# Altium schematic sheet NEW_TOP.SchDoc
size A; DocumentNumber: 2; SheetNumber: 2; SheetTotal: 5
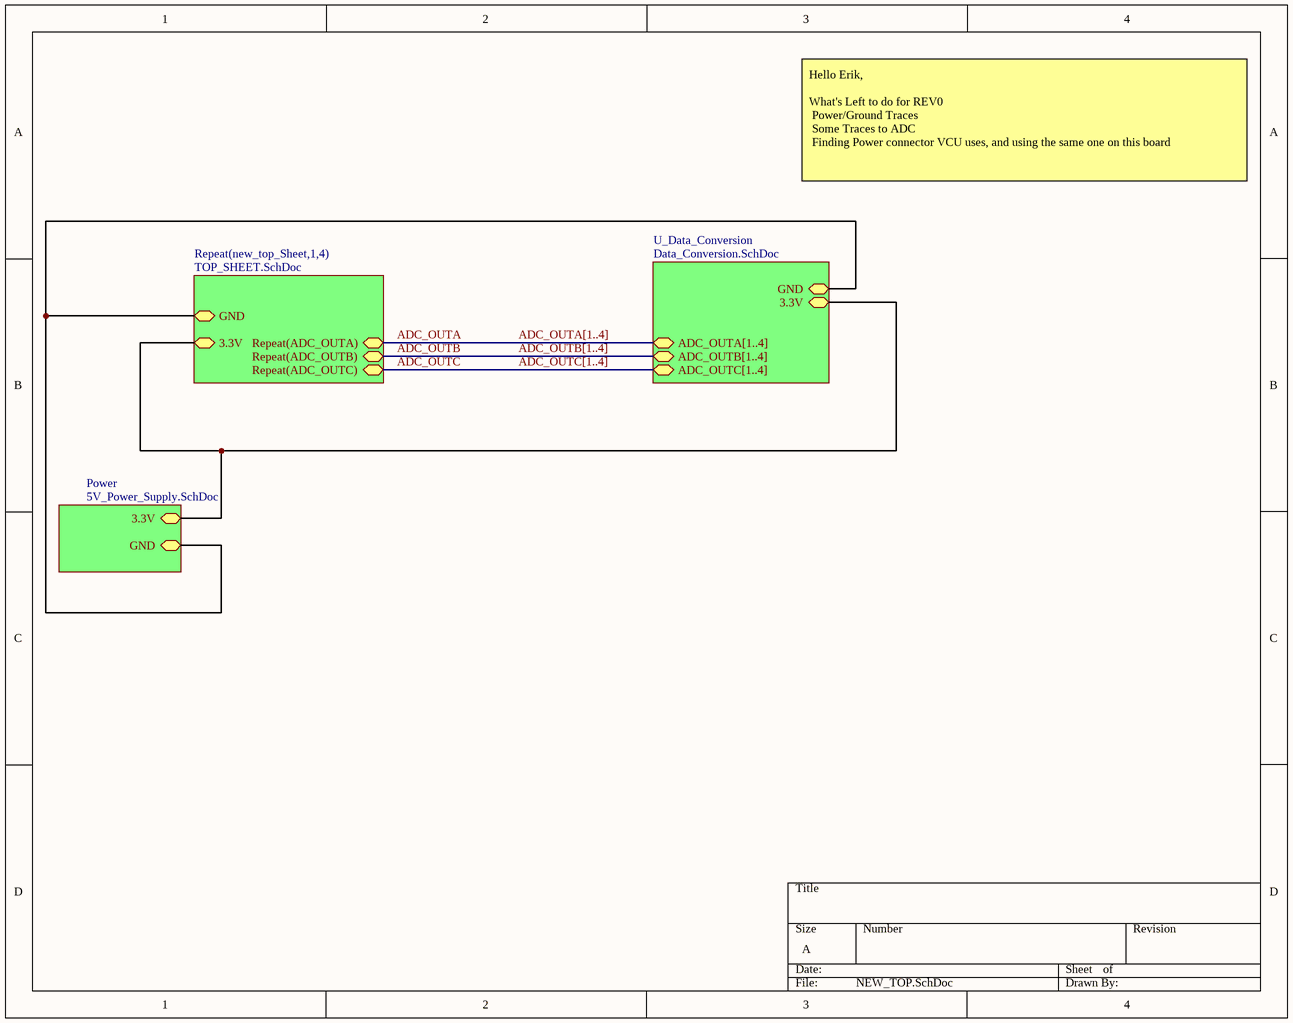
[diagram p0: NEW_TOP.SchDoc]

## Sub-sheets
Power = 5V_Power_Supply.SchDoc: 3.3V (bidir), GND (bidir)
Repeat(new_top_Sheet,1,4) = TOP_SHEET.SchDoc: Repeat(ADC_OUTA) (bidir), Repeat(ADC_OUTB) (bidir), Repeat(ADC_OUTC) (bidir), 3.3V (bidir), GND (bidir)
U_Data_Conversion = Data_Conversion.SchDoc: ADC_OUTA[1..4] (bidir), ADC_OUTB[1..4] (bidir), ADC_OUTC[1..4] (bidir), 3.3V (bidir), GND (bidir)

## Nets
ADC_OUTA: sheet Repeat(new_top_Sheet,1,4)/Repeat(ADC_OUTA)
ADC_OUTB: sheet Repeat(new_top_Sheet,1,4)/Repeat(ADC_OUTB)
ADC_OUTC: sheet Repeat(new_top_Sheet,1,4)/Repeat(ADC_OUTC)
(unnamed): sheet Repeat(new_top_Sheet,1,4)/3.3V, sheet U_Data_Conversion/3.3V, sheet Power/3.3V
(unnamed): sheet Repeat(new_top_Sheet,1,4)/GND, sheet U_Data_Conversion/GND, sheet Power/GND

## Buses and harness runs
bus ADC_OUTA[1..4] = sheet U_Data_Conversion/ADC_OUTA[1..4]
bus ADC_OUTB[1..4] = sheet U_Data_Conversion/ADC_OUTB[1..4]
bus ADC_OUTC[1..4] = sheet U_Data_Conversion/ADC_OUTC[1..4]

## Notes on the sheet
- Hello Erik,
  What's Left to do for REV0
  Power/Ground Traces
  Some Traces to ADC
  Finding Power connector VCU uses, and using the same one on this board